# Altium schematic sheet SPI-I2C-Shield.SchDoc: SPI-I2C-Blank-Shield
size A4
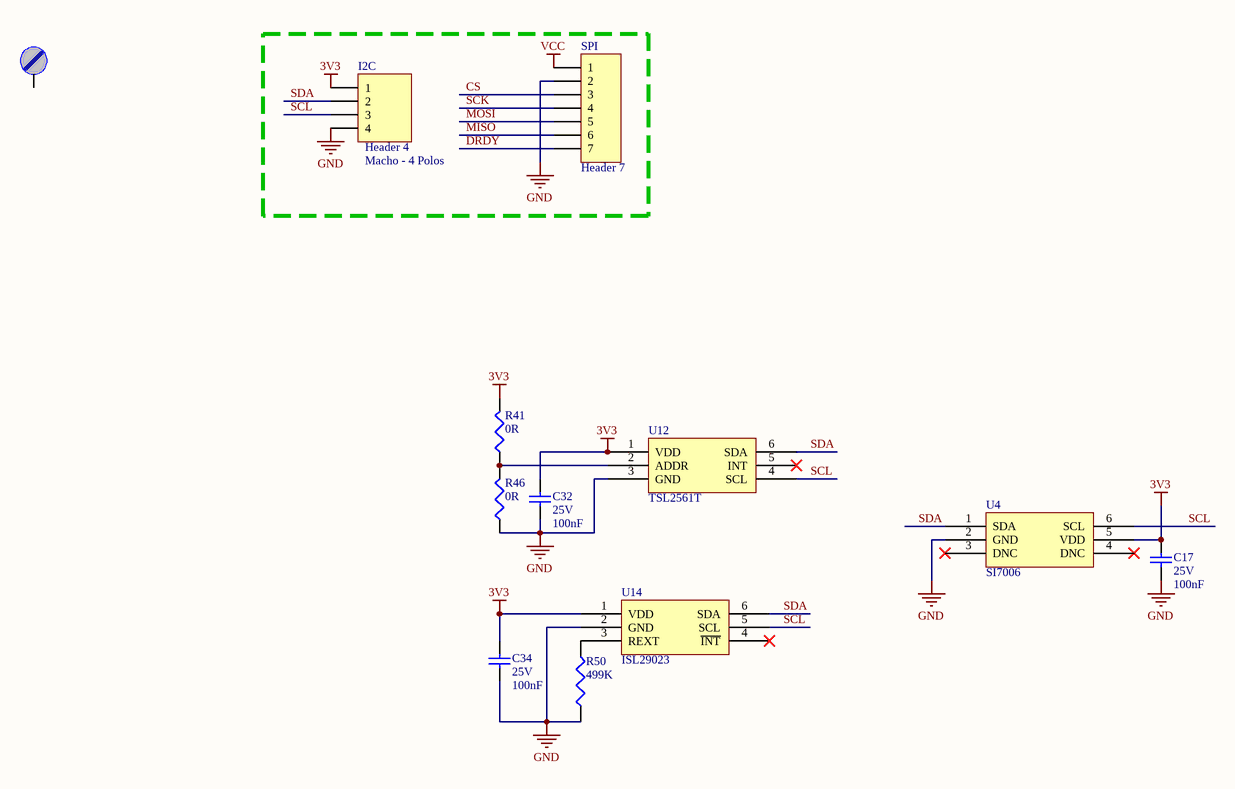
[diagram p0: SPI-I2C-Shield.SchDoc]

## Parts
C17  value 100nF  Tensão: 25V  [CC0603]  (hidden comment: Capacitor Cerâmico)
C32  value 100nF  Tensão: 25V  [CC0603]  (hidden comment: Capacitor Cerâmico)
C34  value 100nF  Tensão: 25V  [CC0603]  (hidden comment: Capacitor Cerâmico)
I2C  Header 4  value Macho - 4 Polos  [CONN HDR1X4]
M2  Furo de Fixação  [Furo_M3]  (value not drawn)  (no BOM)
R41  value 0R  [CC0603]  (hidden comment: Resistor)
R46  value 0R  [CC0603]  (hidden comment: Resistor)
R50  value 499K  [CC0603]  (hidden comment: Resistor)
SPI  Header 7  [CONN HDR1X7]
U4  SI7006  [QFN3x3-6P]
U12  TSL2561T  [TSL2561-TMB6]
U14  ISL29023  [QFN2x2-6]

## Nets
3V3: C17.2 C32.2 C34.2 I2C.1 R41.2 U4.5(VDD) U12.1(VDD) U14.1(VDD)
GND: C17.1 C32.1 C34.1 I2C.4 R46.1 R50.1 SPI.2 U4.2(GND) U12.3(GND) U14.2(GND)
VCC: SPI.1
CS: SPI.3
DRDY: SPI.7
MISO: SPI.6
MOSI: SPI.5
SCK: SPI.4
SCL: I2C.3 U4.6(SCL) U12.4(SCL) U14.5(SCL)
SDA: I2C.2 U4.1(SDA) U12.6(SDA) U14.6(SDA)
NetR41_1: R41.1 R46.2 U12.2(ADDR)
NetR50_2: R50.2 U14.3(REXT)

Not connected (* = marked no-connect by the designer): M2 X; U4 3(DNC)* 4(DNC)*; U12 5(INT)*; U14 4(~{INT})*

## Notes on the sheet
- Projeto:
- Tamanho:
- Data:
- A4
- Eng. Felipe Navarro
- Hora:
- Revisão:
- Folha
- de
- Arquivo:

## Library data of the parts
C17 C32 C34 = Cap 100nF 25V 0603 X7R: Capacitor (Semiconductor SIM Model); Chinês: Local; ChinesePrice: 0,00246; Corrente: *A; Potência: *W; Obs:: X7R; Tolerância: ±10%; Supplier 1: Digi-Key; Supplier Part Number 1: 490-1524-1-ND; ComponentLink1Description: Datasheet; ComponentLink1URL: D:\Tecnoclade\Datasheet\!DataMissing.pdf
I2C = Header 4: Header, 4-Pin; ChinesePrice: 0,10000; Chinês: Proved - Local; Obs:: Barra de 40 pinos - ATENÇÃO; Corrente: *; Potência: *; Supplier 1: Digi-Key; Supplier Part Number 1: A26509-40-ND; Tensão: *; Tolerância: *; ComponentLink1Description: Datasheet; ComponentLink1URL: D:\Tecnoclade\Datasheet\!DataMissing.pdf
M2 = Parafuso: Furo para parafuso; Value: M3; ChinesePrice: 0,00000; Chinês: ----; Supplier 1: Digi-Key; Supplier Part Number 1: --Del; Corrente: *; Potência: *; Tensão: *; Tolerância: *; Obs:: *; ComponentLink1Description: Datasheet; ComponentLink1URL: D:\Tecnoclade\Datasheet\!DataMissing.pdf
R41 R46 = Res 0R 0603 1/10W: ChinesePrice: 0,00089; Chinês: Local; Corrente: *A; Potência: 1/10W; Tensão: *V; Tolerância: Jumper; Supplier 1: Digi-Key; Supplier Part Number 1: P0.0GCT-ND; Obs: *; ComponentLink1Description: Datasheet; ComponentLink1URL: D:\Tecnoclade\Datasheet\!DataMissing.pdf
R50 = Res 499K 1% 0603 1/10W: ChinesePrice: 0,00000; Chinês: ----; Corrente: *A; Potência: 1/10W; Tensão: *V; Tolerância: 1±*%; Supplier 1: Digi-Key; Supplier Part Number 1: 311-499KHRCT-ND; Obs:: *; ComponentLink1Description: Datasheet; ComponentLink1URL: D:\Tecnoclade\Datasheet\!DataMissing.pdf
SPI = Header 7: Header, 7-Pin; ChinesePrice: 0,10000; Chinês: Proved - Local; Value: Barra de 40 pinos - ATENÇÃO; Corrente: *; Potência: *; Supplier 1: Digi-Key; Supplier Part Number 1: A26509-40-ND; Tensão: *; Obs:: *; Tolerância: *; ComponentLink1Description: Datasheet; ComponentLink1URL: D:\Tecnoclade\Datasheet\!DataMissing.pdf
U4 = SI7006: SI7021-A20-GM1; ChinesePrice: 0,00000; Chinês: ----; Corrente: *; Potência: *; Tensão: *; Value: *; Supplier 1: Digi-Key; Supplier Part Number 1: 336-3141-ND; Obs:: *; Tolerância: *; ComponentLink1Description: Datasheet; ComponentLink1URL: https://www.silabs.com/Support%20Documents%2FTechnicalDocs%2FSi7006-A20.pdf
U12 = TSL2561T: Lux Meter; ChinesePrice: 0,00000; Chinês: ----; Corrente: *; Potência: *; Tensão: *; Value: *; Supplier 1: Digi-Key; Supplier Part Number 1: TSL2561-TCT-ND; Obs:: *; Tolerância: *; ComponentLink1Description: Datasheet; ComponentLink1URL: https://www.silabs.com/Support%20Documents%2FTechnicalDocs%2FSi7006-A20.pdf
U14 = ISL29023: Lux Meter; ChinesePrice: 0,00000; Chinês: ----; Corrente: *; Potência: *; Tensão: *; Value: *; Supplier 1: Digi-Key; Supplier Part Number 1: ISL29023IROZ-T7CT-ND; Obs:: *; Tolerância: *; ComponentLink1Description: Datasheet; ComponentLink1URL: https://www.silabs.com/Support%20Documents%2FTechnicalDocs%2FSi7006-A20.pdf